# Altium schematic sheet MODULIQ_RF_Detector.SchDoc: RF Detector
size A3; Author: M.Beldyga; CompanyName: WUT ISE; DrawnBy: M.Beldyga; Organization: WUT ISE; Address1: PW ISE; Address2: Nowowiejska 15/19 00-665 Warsaw; Address3: micbeldyga@gmail.com; SheetNumber: 1; SheetTotal: 2; ModifiedBy: -; CheckedDate: -; Title2: MODULIQ; DivGrp: WUT ISE; Designer: M.Beldyga; ModifiedDate: -; ProjectName: Sensor Box
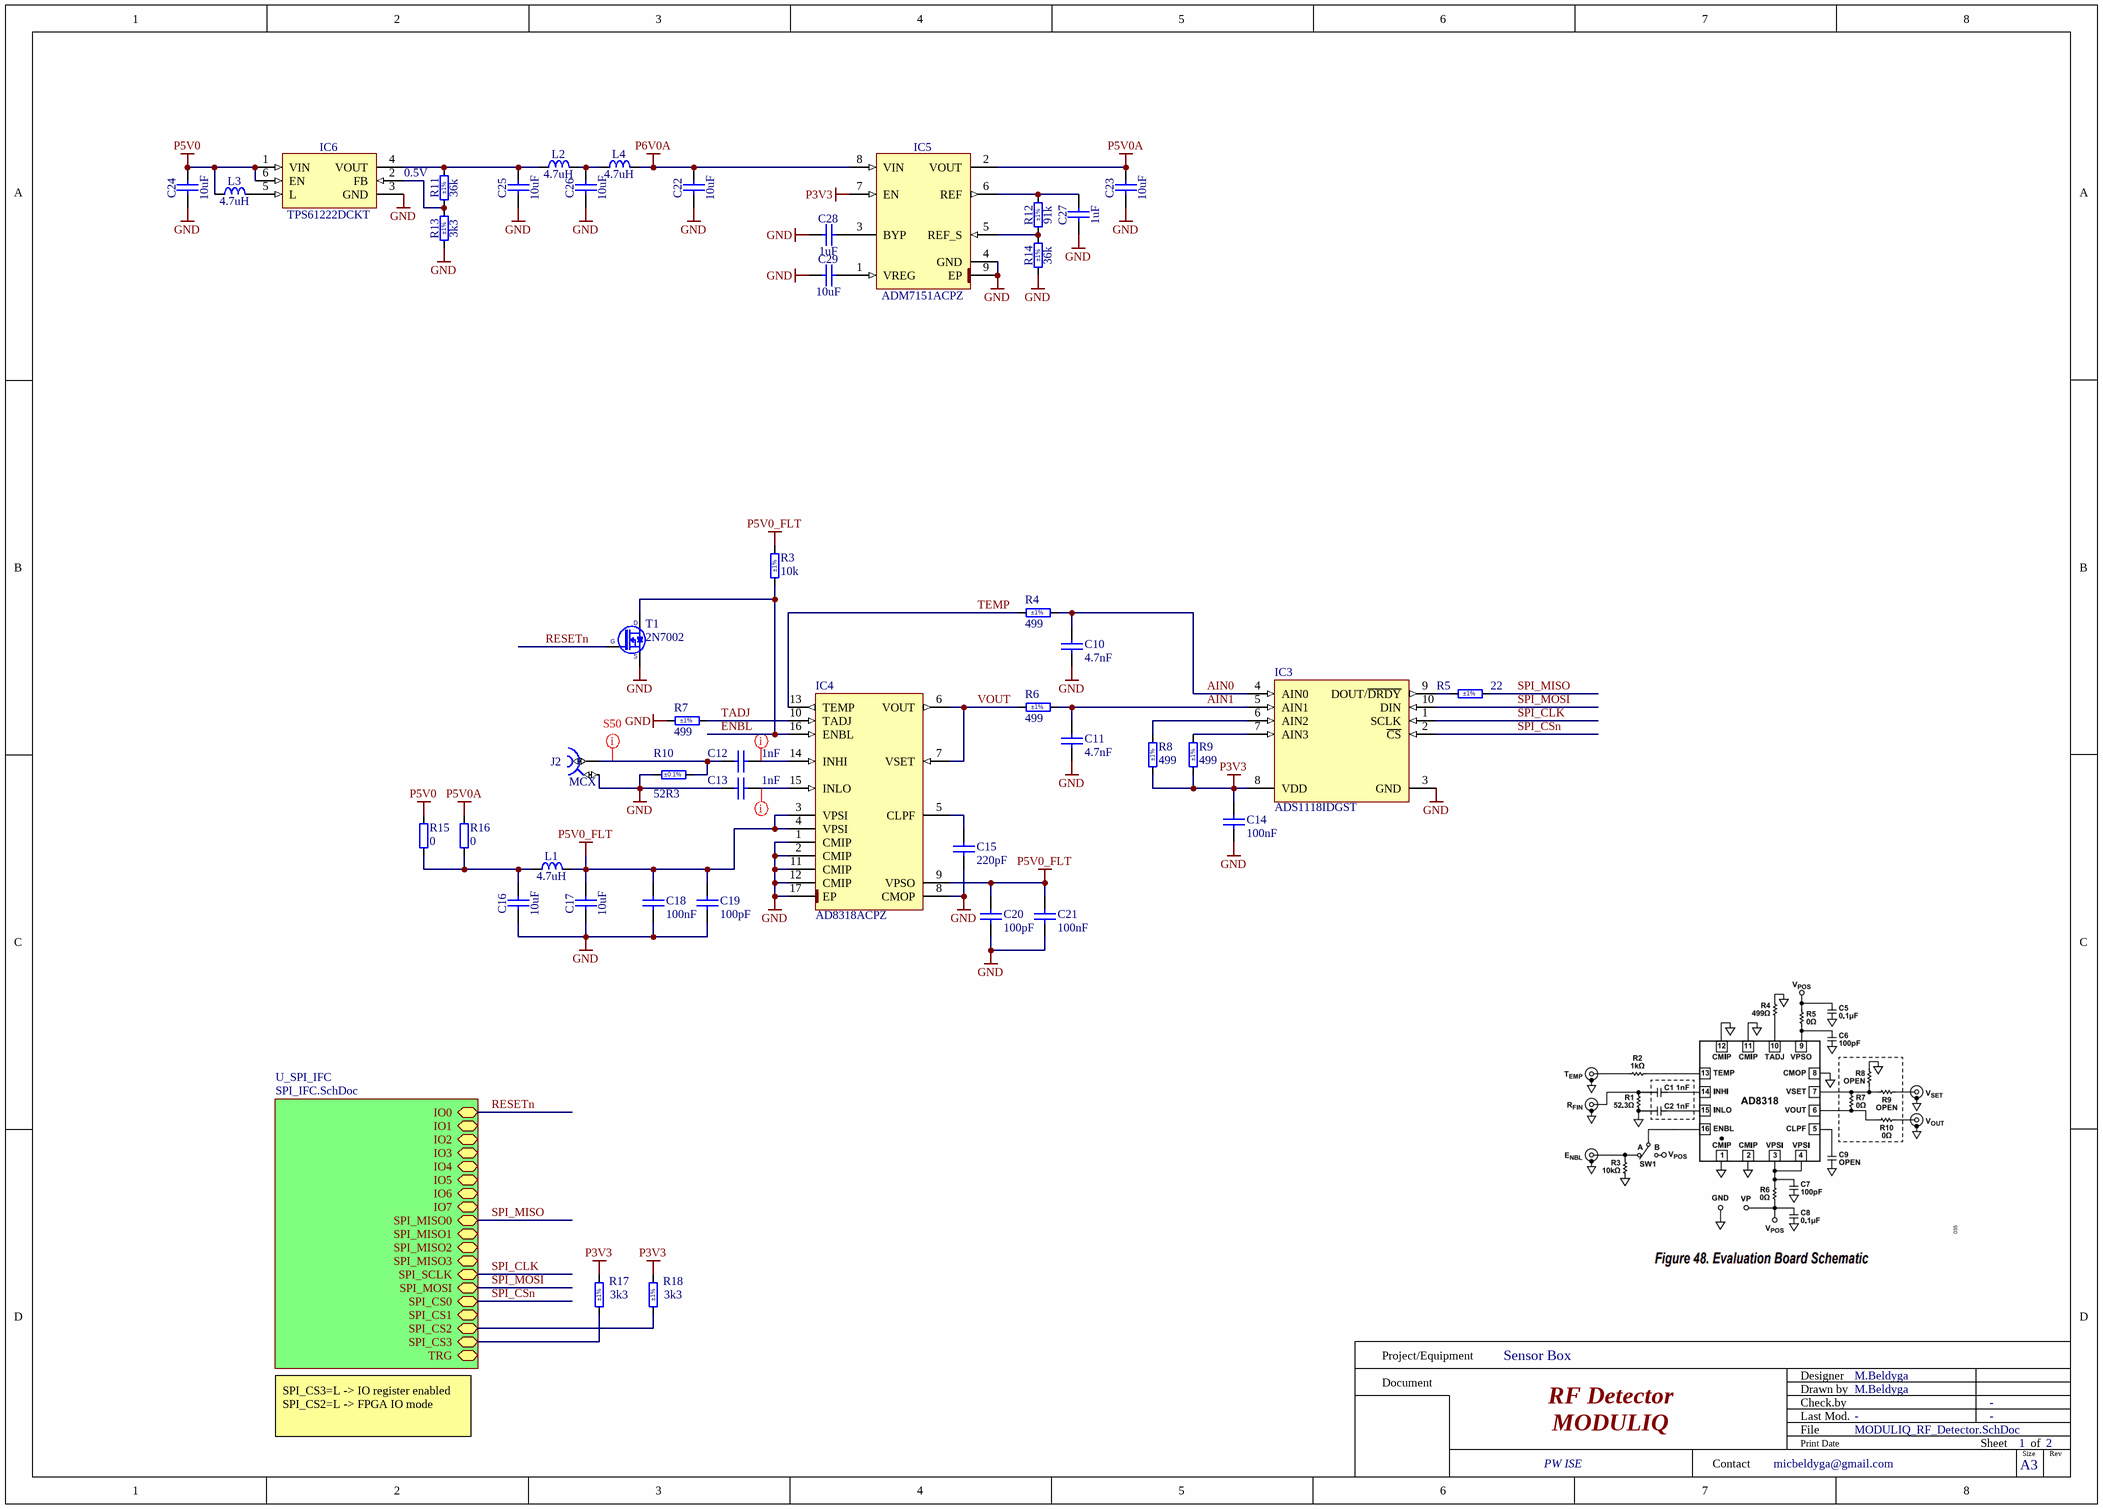
[diagram p0: MODULIQ_RF_Detector.SchDoc]

## Parts
C10  4.7nF  [CAPC1005X55N]
C11  4.7nF  [CAPC1005X55N]
C12  1nF  [CAPC1005X55N]
C13  1nF  [CAPC1005X55N]
C14  100nF  [CAPC1005X55N]
C15  220pF  [CAPC1005X55N]
C16  10uF  [CAPC2012X135N]
C17  10uF  [CAPC2012X135N]
C18  100nF  [CAPC1005X55N]
C19  100pF  [CAPC1005X55N]
C20  100pF  [CAPC1005X55N]
C21  100nF  [CAPC1005X55N]
C22  10uF  [CAPC1608X80N]
C23  10uF  [CAPC1608X80N]
C24  10uF  [CAPC1608X80N]
C25  10uF  [CAPC1608X80N]
C26  10uF  [CAPC1608X80N]
C27  1uF  [CAPC1005X55N]
C28  1uF  [CAPC1005X55N]
C29  10uF  [CAPC1608X80N]
IC3  ADS1118IDGST  [SOP50P490X110-10N]
IC4  AD8318ACPZ  [QFN65P400X400X100-17N-S225]
IC5  ADM7151ACPZ  [SON50P300X300X80-9N-R170X244]
IC6  TPS61222DCKT  [SOT65P210X110-6N]
J2  MCX  [AMPHENOL_919-109J-51PX]
L1  4.7uH  [INDC2520X120N]
L2  4.7uH  [INDC2520X120N]
L3  4.7uH  [INDC2520X120N]
L4  4.7uH  [INDC2520X120N]
R3  10k  Tolerance: ±1%  [RESC1005X40N]
R4  499  Tolerance: ±1%  [RESC1005X40N]
R5  22  Tolerance: ±1%  [RESC1005X40N]
R6  499  Tolerance: ±1%  [RESC1005X40N]
R7  499  Tolerance: ±1%  [RESC1005X40N]
R8  499  Tolerance: ±1%  [RESC1005X40N]
R9  499  Tolerance: ±1%  [RESC1005X40N]
R10  52R3  Tolerance: ±0.1%  [RESC1608X55N]
R11  36k  Tolerance: ±1%  [RESC1005X40N]
R12  91k  Tolerance: ±1%  [RESC1005X40N]
R13  3k3  Tolerance: ±1%  [RESC1005X40N]
R14  36k  Tolerance: ±1%  [RESC1005X40N]
R15  0  [RESC1005X40N]
R16  0  [RESC1005X40N]
R17  3k3  Tolerance: ±1%  [RESC1005X40N]
R18  3k3  Tolerance: ±1%  [RESC1005X40N]
T1  2N7002  [SOT95P240X130-3N]

## Sub-sheets
U_SPI_IFC = SPI_IFC.SchDoc: IO0 (bidir), IO1 (bidir), IO2 (bidir), IO3 (bidir), IO4 (bidir), IO5 (bidir), IO6 (bidir), IO7 (bidir), SPI_MISO0 (bidir), SPI_MISO1 (bidir), SPI_MISO2 (bidir), SPI_MISO3 (bidir), SPI_SCLK (bidir), SPI_MOSI (bidir), SPI_CS0 (bidir), SPI_CS1 (bidir), SPI_CS2 (bidir), SPI_CS3 (bidir), TRG (bidir)

## Nets
GND: C10.1 C11.1 C13.1 C14.1 C15.1 C16.1 C17.1 C18.1 C19.1 C20.1 C21.1 C22.1 C23.1 C24.1 C25.1 C26.1 C27.1 C28.1 C29.1 IC3.3(GND) IC4.1(CMIP) IC4.2(CMIP) IC4.8(CMOP) IC4.11(CMIP) IC4.12(CMIP) IC4.17(EP) IC5.4(GND) IC5.9(EP) IC6.3(GND) J2.2 R7.1 R10.1 R13.1 R14.1 T1.2(S)
P3V3: C14.2 IC3.8(VDD) IC5.7(EN) R8.1 R9.1 R17.1 R18.1
P5V0: C24.2 IC6.1(VIN) IC6.6(EN) L3.1 R15.2
P5V0_FLT: C17.2 C18.2 C19.2 C20.2 C21.2 IC4.3(VPSI) IC4.4(VPSI) IC4.9(VPSO) L1.2 R3.2
P5V0A: C23.2 IC5.2(VOUT) R16.2
P6V0A: C22.2 IC5.8(VIN) L4.2
AIN0: C10.2 IC3.4(AIN0) R4.2
AIN1: C11.2 IC3.5(AIN1) R6.2
ENBL: IC4.16(ENBL) R3.1 T1.3(D)
RESETn: T1.1(G) ; sheet U_SPI_IFC/IO0
SPI_CLK: IC3.1(SCLK) ; sheet U_SPI_IFC/SPI_SCLK
SPI_CSn: IC3.2(~{CS}) ; sheet U_SPI_IFC/SPI_CS0
SPI_MISO: R5.2 ; sheet U_SPI_IFC/SPI_MISO0
SPI_MOSI: IC3.10(DIN) ; sheet U_SPI_IFC/SPI_MOSI
TADJ: IC4.10(TADJ) R7.2
TEMP: IC4.13(TEMP) R4.1
VOUT: IC4.6(VOUT) IC4.7(VSET) R6.1
NetC12_1: C12.1 J2.1 R10.2
NetC12_2: C12.2 IC4.14(INHI)
NetC13_2: C13.2 IC4.15(INLO)
NetC15_2: C15.2 IC4.5(CLPF)
NetC16_2: C16.2 L1.1 R15.1 R16.1
NetC25_2: C25.2 IC6.4(VOUT) L2.1 R11.2
NetC26_2: C26.2 L2.2 L4.1
NetC27_2: C27.2 IC5.6(REF) R12.2
NetC28_2: C28.2 IC5.3(BYP)
NetC29_2: C29.2 IC5.1(VREG)
NetIC3_6: IC3.6(AIN2) R8.2
NetIC3_7: IC3.7(AIN3) R9.2
NetIC3_9: IC3.9(DOUT/~{DRDY}) R5.1
NetIC5_5: IC5.5(REF_S) R12.1 R14.2
NetIC6_2: IC6.2(FB) R11.1 R13.2
NetIC6_5: IC6.5(L) L3.2
NetR17_2: R17.2 ; sheet U_SPI_IFC/SPI_CS3
NetR18_2: R18.2 ; sheet U_SPI_IFC/SPI_CS2

## Layout directives
net class S50: NetC12_1, NetC12_2, NetC13_2

## Notes on the sheet
- 0.5V
- SPI_CS3=L -> IO register enabled
  SPI_CS2=L -> FPGA IO mode
- Project/Equipment
- Document
- Designer
- Drawn by
- Check.by
- Contact
- File
- Last Mod.
- Print Date
- Sheet
- Size
- A3
- of
- Rev

## Library data of the parts
C10 C11 = CC0402_4.7NF_16V_10%_X7R: Non-polarised capacitor; Part Description: SMD Multilayer Chip Ceramic Capacitor; Manufacturer: GENERIC; Manufacturer1 Part Number: 223878715632; Voltage: 16V; TC: X7R; Tolerance: ±10%; Part Number: CC0402_4.7NF_16V_10%_X7R; Component Kind: Standard; Component Type: Standard; Pin Count: 2; Value: 4.7nF; Status: Not Recommended; Manufacturer Part Number: CC0402_4.7NF_16V_10%_X7R; Case: 0402; Mounted: Yes; Socket: No; SMD: Yes; Sense: No; Manufacturer1 Example: PHYCOMP; Manufacturer1 ComponentHeight: 0.55mm; HelpURL: \\cern.ch\dfs\Applications\Altium\Datasheets\CC0402_X7R_PHYCOMP.pdf; Author: CERN DEM JLC; CreateDate: 12/3/2007; LatestRevisionDate: 12/3/2007
C12 C13 = CC0402_1NF_50V_5%_C0G: Non-polarised capacitor; Part Description: SMD Multilayer Chip Ceramic Capacitor; Manufacturer: GENERIC; Manufacturer1 Part Number: C0402C102J5GACTU; Voltage: 50V; TC: C0G/NP0; Tolerance: ±5%; Part Number: CC0402_1NF_50V_5%_C0G; Component Kind: Standard; Component Type: Standard; Pin Count: 2; Value: 1nF; Status: Preferred; Manufacturer Part Number: CC0402_1NF_50V_5%_C0G; Case: 0402; Mounted: Yes; Socket: No; SMD: Yes; Sense: No; Manufacturer1 Example: KEMET; Manufacturer1 ComponentHeight: 0.55mm; HelpURL: \\cern.ch\dfs\Applications\Altium\Datasheets\CC0402_C0G_KEMET_(Commercial Grade).pdf; Author: CERN DEM BC; CreateDate: 9/2/2019; LatestRevisionDate: 9/2/2019
C14 C18 C21 = CC0402_100NF_16V_10%_X7R: Non-polarised capacitor; Part Description: SMD Multilayer Chip Ceramic Capacitor; Manufacturer: GENERIC; Manufacturer1 Part Number: GRM155R71C104KA88D; Voltage: 16V; TC: X7R; Tolerance: ±10%; Part Number: CC0402_100NF_16V_10%_X7R; Component Kind: Standard; Component Type: Standard; Pin Count: 2; Value: 100nF; Status: Not Recommended; Manufacturer Part Number: CC0402_100NF_16V_10%_X7R; Case: 0402; Mounted: Yes; Socket: No; SMD: Yes; Sense: No; Manufacturer1 Example: MURATA; Manufacturer1 ComponentHeight: 0.55mm; HelpURL: \\cern.ch\dfs\Applications\Altium\Datasheets\CC0402_X7R_MURATA_GRM.pdf; Author: CERN DEM JLC; CreateDate: 12/5/2013; LatestRevisionDate: 12/3/2007
C15 = CC0402_220PF_50V_1%_C0G: Non-polarised capacitor; Part Description: SMD Multilayer Chip Ceramic Capacitor; Manufacturer: GENERIC; Manufacturer1 Part Number: C0402C221F5GAC; Voltage: 50V; TC: C0G/NP0; Tolerance: ±1%; Part Number: CC0402_220PF_50V_1%_C0G; Component Kind: Standard; Component Type: Standard; Pin Count: 2; Value: 220pF; Status: Preferred; Manufacturer Part Number: CC0402_220PF_50V_1%_C0G; Case: 0402; Mounted: Yes; Socket: No; SMD: Yes; Sense: No; Manufacturer1 Example: KEMET; Manufacturer1 ComponentHeight: 0.55mm; HelpURL: \\cern.ch\dfs\Applications\Altium\Datasheets\CC0402_C0G_KEMET_(Commercial Grade).pdf; Author: CERN DEM BC; CreateDate: 7/14/2020; LatestRevisionDate: 7/14/2020
C16 C17 = CC0805_10UF_16V_10%_X5R: Non-polarised capacitor; Part Description: SMD Multilayer Chip Ceramic Capacitor; Manufacturer: GENERIC; Manufacturer1 Part Number: C0805C106K4PAC; Voltage: 16V; TC: X5R; Tolerance: ±10%; Part Number: CC0805_10UF_16V_10%_X5R; Component Kind: Standard; Component Type: Standard; Pin Count: 2; Value: 10uF; Status: Preferred; Manufacturer Part Number: CC0805_10UF_16V_10%_X5R; Case: 0805; Mounted: Yes; Socket: No; SMD: Yes; Sense: No; Manufacturer1 Example: KEMET; Manufacturer1 ComponentHeight: 1.4mm; HelpURL: \\cern.ch\dfs\Applications\Altium\Datasheets\CC1206_X5R_KEMET.pdf; Author: CERN DEM JLC; CreateDate: 03.12.2007; LatestRevisionDate: 03.12.2007
C19 C20 = CC0402_100PF_25V_1%_C0G: Non-polarised capacitor; Part Description: SMD Multilayer Chip Ceramic Capacitor; Manufacturer: GENERIC; Manufacturer1 Part Number: CBR04C101F3GAC; Voltage: 25V; TC: C0G/NP0; Tolerance: ±1%; Part Number: CC0402_100PF_25V_1%_C0G; Component Kind: Standard; Component Type: Standard; Pin Count: 2; Value: 100pF; Status: Not Recommended; Manufacturer Part Number: CC0402_100PF_25V_1%_C0G; Case: 0402; Mounted: Yes; Socket: No; SMD: Yes; Sense: No; Manufacturer1 Example: KEMET; Manufacturer1 ComponentHeight: 0.55mm; HelpURL: \\cern.ch\dfs\Applications\Altium\Datasheets\CC0402_C0G_KEMET_HiQ-CBR.pdf; Author: CERN DEM HF; CreateDate: 10/20/2022; LatestRevisionDate: 10/20/2022
C22-C26 C29 = CC0603_10UF_10V_10%_X5R: Non-polarised capacitor; Part Description: SMD Multilayer Chip Ceramic Capacitor; Manufacturer: GENERIC; Manufacturer1 Part Number: GRM188R61A106KE69D; Voltage: 10V; TC: X5R; Tolerance: ±10%; Part Number: CC0603_10UF_10V_10%_X5R; Component Kind: Standard; Component Type: Standard; Pin Count: 2; Value: 10uF; Status: None; Manufacturer Part Number: CC0603_10UF_10V_10%_X5R; Case: 0603; Mounted: Yes; Socket: No; SMD: Yes; Sense: No; Manufacturer1 Example: MURATA; Manufacturer1 ComponentHeight: 0.8mm; HelpURL: \\cern.ch\dfs\Applications\Altium\Datasheets\CC0603_MURATA_GRM188R61A106KE69D.pdf; Author: CERN DEM JLC; CreateDate: 31.01.2017; LatestRevisionDate: 31.01.2017
C27 C28 = CC0402_1UF_16V_10%_X5R: Non-polarised capacitor; Part Description: SMD Multilayer Chip Ceramic Capacitor; Manufacturer: GENERIC; Manufacturer1 Part Number: C1005X5R1C105KT; Voltage: 16V; TC: X5R; Tolerance: ±10%; Part Number: CC0402_1UF_16V_10%_X5R; Component Kind: Standard; Component Type: Standard; Pin Count: 2; Value: 1uF; Status: Preferred; Manufacturer Part Number: CC0402_1UF_16V_10%_X5R; Case: 0402; Mounted: Yes; Socket: No; SMD: Yes; Sense: No; Manufacturer1 Example: TDK; Manufacturer1 ComponentHeight: 0.55mm; HelpURL: \\cern.ch\dfs\Applications\Altium\Datasheets\CC0402_X5R_TDK_C.pdf; Author: CERN DEM JLC; CreateDate: 25.10.2012; LatestRevisionDate: 25.10.2012
IC3 = ADS1118IDGST: Quad Channel Single ADC Delta-Sigma 860sps 16-bit Serial 10-Pin VSSOP T/R; Manufacturer: Texas Instruments; Min Supply Voltage: 2V; Max Supply Voltage: 5.5V; Number of Channels: 2; Max Power Dissipation: 900uW; Operating Supply Voltage: 3.3V; Interface: SPI; Number of Bits: 16; Number of Converters: 1; Resolution: 16b; Sampling Rate: 860S/s; Polarity: Bipolar; Integral Nonlinearity (INL): 1LSB; Number of Inputs: 4; Supply Current: 150uA; Supplier: Mouser; Supplier Part Number: 595-ADS1118IDGST; Manufacturer Part Number: ADS1118IDGST; RoHS: Yes; Category: Analog to Digital Converters (ADCs); Stock: 2422; Pricing: 1=6.29, 10=4.83, 25=4.47, 50=4.47, 100=4.07, 250=3.87, 500=3.69, 1000=3.59, 2500=3.5, 10000=3.59 (USD); Case/Package: VSSOP; Pins: 10; Contact Plating: Gold; Min Operating Temperature: -40°C; Max Operating Temperature: 125°C; Package Quantity: 250; Packaging: Tape and Reel; Number of A/D Converters: 1; Number of Elements: 1; Supply Type: Single; Conversion Rate: 860S/s; Max Supply Voltage (DC): 5.5V; Min Supply Voltage (DC): 2V; Power Dissipation: 900uW; Series: -; Length: 3.1mm; Width: 3.1mm; Height: 1.1mm; Thickness: 1.02mm; Reach SVHC Compliant: No; Lead Free: Lead Free; RoHS Compliant: Yes; ComponentLink1URL: https://datasheet.ciiva.com/7989/1634024-7989312.pdf?src-supplier=Element14; ComponentLink1Description: https://datasheet.ciiva.com/7989/1634024-7989312.pdf?src-supplier=Element14; ComponentLink2URL: https://datasheet.ciiva.com/41461/001186694-da-01-en-ic-adc-16bit-sp-ads1118idgst-msop-10-tid-41461012.pdf?src-supplier=Conrad; ComponentLink2Description: https://datasheet.ciiva.com/41461/001186694-da-01-en-ic-adc-16bit-sp-ads1118idgst-msop-10-tid-41461012.pdf?src-supplier=Conrad; ComponentLink3URL: https://datasheet.ciiva.com/1261/ads1118-1261457.pdf?src-supplier=Digikey; ComponentLink3Description: https://datasheet.ciiva.com/1261/ads1118-1261457.pdf?src-supplier=Digikey; ComponentLink4URL: https://datasheet.ciiva.com/1261/ads1118-1261458.pdf?src-supplier=Digikey; ComponentLink4Description: https://datasheet.ciiva.com/1261/ads1118-1261458.pdf?src-supplier=Digikey; ComponentLink5URL: https://datasheet.ciiva.com/1261/ads1118-1261459.pdf?src-supplier=Digikey; ComponentLink5Description: https://datasheet.ciiva.com/1261/ads1118-1261459.pdf?src-supplier=Digikey; ComponentLink6URL: https://datasheet.ciiva.com/14259/ads1118-14259989.pdf?src-supplier=Avnet; ComponentLink6Description: https://datasheet.ciiva.com/14259/ads1118-14259989.pdf?src-supplier=Avnet; ComponentLink7URL: https://datasheet.ciiva.com/46394/1793017-46394506.pdf?src-supplier=Element14; ComponentLink7Description: https://datasheet.ciiva.com/46394/1793017-46394506.pdf?src-supplier=Element14; ComponentLink8URL: https://datasheet.ciiva.com/46394/1793017-46394507.pdf?src-supplier=Element14; ComponentLink8Description: https://datasheet.ciiva.com/46394/1793017-46394507.pdf?src-supplier=Element14
IC4 = AD8318ACPZ: 1MHz to 8GHz, 70 dB Logarithmic Detector/Controller; Manufacturer: ANALOG DEVICES; PressFit: No; Bonding: No; Part Number: AD8318ACPZ; Component Kind: Standard; Component Type: Standard; Device: AD8318ACPZ; PackageDescription: QFN, 0.65mm Pitch, Square; 16 Pin, 4.00mm L X 4.00mm W X 1.00mm H body (w/Thermal Tab 2.25 X 2.25mm), IPC Medium Density; Part Description: 1MHz to 8GHz, 70 dB Logarithmic Detector/Controller; Manufacturer Part Number: AD8318ACP; Pin Count: 17; Case: QFN16; Mounted: Yes; Socket: No; SMD: Yes; Sense: No; ComponentHeight: 1mm; Author: CERN DEM JLC; HelpURL: \\cern.ch\dfs\Applications\Altium\Datasheets\AD8318ACPZ.pdf; CreateDate: 1/20/2011; LatestRevisionDate: 3/25/2022
IC5 = ADM7151ACPZ: 800 mA Ultralow Noise, High PSRR, RF Linear Regulator; Part Description: Adjustable 1.5V to 5.1V, 800 mA Ultralow Noise, High PSRR, RF Linear Regulator; Manufacturer: ANALOG DEVICES; PressFit: No; Bonding: No; Part Number: ADM7151ACPZ; Component Kind: Standard; Component Type: Standard; Device: ADM7151ACPZ; PackageDescription: SON, (DFN) 0.50mm Pitch; 8 pin, 3.00mm W X 3.00mm L X 0.80mm H body (w/Thermal Tab 1.70 X2.44mm), IPC Medium Density; Manufacturer Part Number: ADM7151ACP; Pin Count: 9; Case: SON8; Mounted: Yes; Socket: No; SMD: Yes; Sense: No; ComponentHeight: 0.8mm; HelpURL: \\cern.ch\dfs\Applications\Altium\Datasheets\ADM7151ACPZ.pdf; Author: CERN DEM JLC; CreateDate: 23.04.2015; LatestRevisionDate: 31.03.2022
IC6 = TPS61222DCKT: Low Input Voltage, 0.7V Boost Converter With 5.5uA Quiescent Current; Manufacturer: TEXAS INSTRUMENTS; PressFit: No; Bonding: No; Part Number: TPS61222DCKT; Component Kind: Standard; Component Type: Standard; Device: TPS61222DCKT; PackageDescription: SOT353, SC70-6, 0.65mm Pitch; 6 Pin, 1.25mm W X 2.00mm L X 1.10mm H body, IPC Medium Density; Part Description: Low Input Voltage, 0.7V Boost Converter with 5.5uA Quiescent Current; Manufacturer Part Number: TPS61222DCK; Pin Count: 6; Case: SOT363; Mounted: Yes; Socket: No; SMD: Yes; Sense: No; ComponentHeight: 1.1mm; HelpURL: \\cern.ch\dfs\Applications\Altium\Datasheets\TPS61222DCKT.pdf; Author: CERN DEM BC; CreateDate: 27.02.2017; LatestRevisionDate: 13.06.2022
J2 = AMPHENOL_919-109J-51PX: Part Description: 50 Ohms, RF Connector, MCX Straight PCB Receptacle Jack; Manufacturer Part Number: 919-109J-51PX (MCX6251B1-3GT30G-50); PressFit: No; Part Number: AMPHENOL_919-109J-51PX; Component Kind: Standard; Component Type: Standard; Pin Count: 5; Family: MCX; Mounted: Yes; Socket: No; SMD: No; Sense: No; Status: None; Manufacturer: AMPHENOL; ComponentHeight: 6.06mm; HelpURL: \\cern.ch\dfs\Applications\Altium\Datasheets\AMPHENOL_919-109J-51PX.pdf; Author: CERN DEM BC; CreateDate: 31.01.2019; LatestRevisionDate: 31.01.2019
L1-L4 = IND1008_4.7UH_20%_MURATA_DFE252012P: Inductor; Part Description: Metal Alloy Power Inductor (DFE252012P Series); Manufacturer: MURATA; Manufacturer Part Number: DFE252012P-4R7M; Power: 2A; Resistance: 0.2R; Tolerance: ±20%; Part Number: IND1008_4.7UH_20%_MURATA_DFE252012P; Component Kind: Standard; Component Type: Standard; Pin Count: 2; Value: 4.7uH; Case: 1008; Mounted: Yes; Socket: No; SMD: Yes; Sense: No; ComponentHeight: 1.2mm; HelpURL: \\cern.ch\dfs\Applications\Altium\Datasheets\IND_MURATA_DFE252012P-4R7M.pdf; Author: CERN DEM BC; CreateDate: 03.09.2020; LatestRevisionDate: 03.09.2020
R3 = R0402_10K_1%_0.0625W_100PPM: Resistor - 1%; Part Description: General Purpose Thick Film Chip Resistor; Manufacturer: GENERIC; Manufacturer1 Part Number: 232270671003L; TC: ±100ppm/°C; PressFit: No; Part Number: R0402_10K_1%_0.0625W_100PPM; Component Kind: Standard; Component Type: Standard; Pin Count: 2; Value: 10k; Status: Not Recommended; Power: 0.0625W; Manufacturer Part Number: R0402_10K_1%_0.0625W_100PPM; Case: 0402; Mounted: Yes; Sense: No; Socket: No; SMD: Yes; Manufacturer1 Example: YAGEO PHYCOMP; Manufacturer1 ComponentHeight: 0.4mm; HelpURL: \\cern.ch\dfs\Applications\Altium\Datasheets\R0402_Phycomp_RC0402.pdf; Author: CERN DEM JLC; CreateDate: 12/3/2007; LatestRevisionDate: 10/17/2012
R4 R6-R9 = R0402_499R_1%_0.1W_100PPM: Resistor - 1%; Part Description: General Purpose Thick Film Chip Resistor; Manufacturer: GENERIC; Manufacturer1 Part Number: ERJ2RKF4990X; Power: 0.1W; TC: ±100ppm/°C; Voltage: 50V; PressFit: No; Part Number: R0402_499R_1%_0.1W_100PPM; Component Kind: Standard; Component Type: Standard; Pin Count: 2; Value: 499; Status: Not Recommended; Manufacturer Part Number: R0402_499R_1%_0.1W_100PPM; Case: 0402; Mounted: Yes; Sense: No; Socket: No; SMD: Yes; Manufacturer1 Example: PANASONIC; Manufacturer1 ComponentHeight: 0.4mm; HelpURL: \\cern.ch\dfs\Applications\Altium\Datasheets\R0402_PANASONIC_ERJ2RK.pdf; Author: CERN DEM MR; CreateDate: 11/22/2016; LatestRevisionDate: 11/22/2016
R5 = R0402_22R_1%_0.0625W_100PPM: Resistor - 1%; Part Description: General Purpose Thick Film Chip Resistor; Manufacturer: GENERIC; Manufacturer1 Part Number: 232270672209L; TC: ±100ppm/°C; PressFit: No; Part Number: R0402_22R_1%_0.0625W_100PPM; Component Kind: Standard; Component Type: Standard; Pin Count: 2; Value: 22; Status: Not Recommended; Power: 0.0625W; Manufacturer Part Number: R0402_22R_1%_0.0625W_100PPM; Case: 0402; Mounted: Yes; Sense: No; Socket: No; SMD: Yes; Manufacturer1 Example: YAGEO PHYCOMP; Manufacturer1 ComponentHeight: 0.4mm; HelpURL: \\cern.ch\dfs\Applications\Altium\Datasheets\R0402_Phycomp_RC0402.pdf; Author: CERN DEM JLC; CreateDate: 12/3/2007; LatestRevisionDate: 10/17/2012
R10 = R0603_52R3_0.1%_0.063W_10PPM: Resistor - 0.1%; Part Description: Thin Film Chip Resistor; Manufacturer: GENERIC; Manufacturer1 Part Number: RN73C1J52R3BTG; Power: 0.063W; TC: ±10ppm; PressFit: No; Part Number: R0603_52R3_0.1%_0.063W_10PPM; Component Kind: Standard; Component Type: Standard; Pin Count: 2; Value: 52R3; Status: Not Recommended; Manufacturer Part Number: R0603_52R3_0.1%_0.063W_10PPM; Case: 0603; Mounted: Yes; Sense: No; Socket: No; SMD: Yes; Manufacturer1 Example: TYCO HOLSWORTHY; Manufacturer1 ComponentHeight: 0.5mm; HelpURL: \\cern.ch\dfs\Applications\Altium\Datasheets\R0603_Tyco_RN73.pdf; Author: CERN DEM JLC; CreateDate: 3/16/2011; LatestRevisionDate: 3/16/2011
R11 R14 = R0402_36K_1%_0.0625W_100PPM: Resistor - 1%; Part Description: General Purpose Thick Film Chip Resistor; Manufacturer: GENERIC; Manufacturer1 Part Number: 232270673603L; TC: ±100ppm/°C; PressFit: No; Part Number: R0402_36K_1%_0.0625W_100PPM; Component Kind: Standard; Component Type: Standard; Pin Count: 2; Value: 36k; Status: Not Recommended; Power: 0.0625W; Manufacturer Part Number: R0402_36K_1%_0.0625W_100PPM; Case: 0402; Mounted: Yes; Sense: No; Socket: No; SMD: Yes; Manufacturer1 Example: YAGEO PHYCOMP; Manufacturer1 ComponentHeight: 0.4mm; HelpURL: \\cern.ch\dfs\Applications\Altium\Datasheets\R0402_Phycomp_RC0402.pdf; Author: CERN DEM JLC; CreateDate: 03.12.2007; LatestRevisionDate: 17.10.2012
R12 = R0402_91K_1%_0.0625W_100PPM: Resistor - 1%; Part Description: General Purpose Thick Film Chip Resistor; Manufacturer: GENERIC; Manufacturer1 Part Number: 232270679103L; TC: ±100ppm/°C; PressFit: No; Part Number: R0402_91K_1%_0.0625W_100PPM; Component Kind: Standard; Component Type: Standard; Pin Count: 2; Value: 91k; Status: Not Recommended; Power: 0.0625W; Manufacturer Part Number: R0402_91K_1%_0.0625W_100PPM; Case: 0402; Mounted: Yes; Sense: No; Socket: No; SMD: Yes; Manufacturer1 Example: YAGEO PHYCOMP; Manufacturer1 ComponentHeight: 0.4mm; HelpURL: \\cern.ch\dfs\Applications\Altium\Datasheets\R0402_Phycomp_RC0402.pdf; Author: CERN DEM JLC; CreateDate: 03.12.2007; LatestRevisionDate: 17.10.2012
R13 R17 R18 = R0402_3K3_1%_0.0625W_100PPM: Resistor - 1%; Part Description: General Purpose Thick Film Chip Resistor; Manufacturer: GENERIC; Manufacturer1 Part Number: 232270673302L; TC: ±100ppm/°C; PressFit: No; Part Number: R0402_3K3_1%_0.0625W_100PPM; Component Kind: Standard; Component Type: Standard; Pin Count: 2; Value: 3k3; Status: Not Recommended; Power: 0.0625W; Manufacturer Part Number: R0402_3K3_1%_0.0625W_100PPM; Case: 0402; Mounted: Yes; Sense: No; Socket: No; SMD: Yes; Manufacturer1 Example: YAGEO PHYCOMP; Manufacturer1 ComponentHeight: 0.4mm; HelpURL: \\cern.ch\dfs\Applications\Altium\Datasheets\R0402_Phycomp_RC0402.pdf; Author: CERN DEM JLC; CreateDate: 03.12.2007; LatestRevisionDate: 17.10.2012
R15 R16 = R0402_0R_JUMPER: Resistor; Part Description: 1A (0.05R Max DC Resistance) Zero Ohm Jumper; Manufacturer: GENERIC; Manufacturer1 Part Number: 232270591001L; PressFit: No; Part Number: R0402_0R_JUMPER; Component Kind: Standard; Component Type: Standard; Pin Count: 2; Value: 0; Status: Not Recommended; Manufacturer Part Number: R0402_0R_JUMPER; Case: 0402; Mounted: Yes; Sense: No; Socket: No; SMD: Yes; Manufacturer1 Example: YAGEO PHYCOMP; Manufacturer1 ComponentHeight: 0.4mm; HelpURL: \\cern.ch\dfs\Applications\Altium\Datasheets\R0402_Phycomp_RC0402.pdf; Author: CERN DEM JLC; CreateDate: 12/3/2007; LatestRevisionDate: 10/17/2012
T1 = 2N7002: N-CHANNEL MOSFET WITH DIODE; Part Description: 60V, 280mA, N-Channel Enhancement Mode Field Effect Transistor (FET); Manufacturer: FAIRCHILD SEMICONDUCTOR; PressFit: No; Bonding: No; Part Number: 2N7002; Component Kind: Standard; Component Type: Standard; Device: 2N7002; PackageDescription: SOT23, 0.95mm Pitch; 3 Pin, 1.30mm W X 2.90mm L X 1.30mm H body, IPC Medium Density; Manufacturer Part Number: 2N7002; Pin Count: 3; Case: SOT23-3; Mounted: Yes; Socket: No; SMD: Yes; Sense: No; ComponentHeight: 1.3mm; HelpURL: \\cern.ch\dfs\Applications\Altium\Datasheets\2N7002.pdf; Author: CERN DEM JLC; CreateDate: 8/20/2008; LatestRevisionDate: 4/7/2009